# EAGLE design pic24_card (EAGLE 9.6.2)

## Sheet 1 of 2
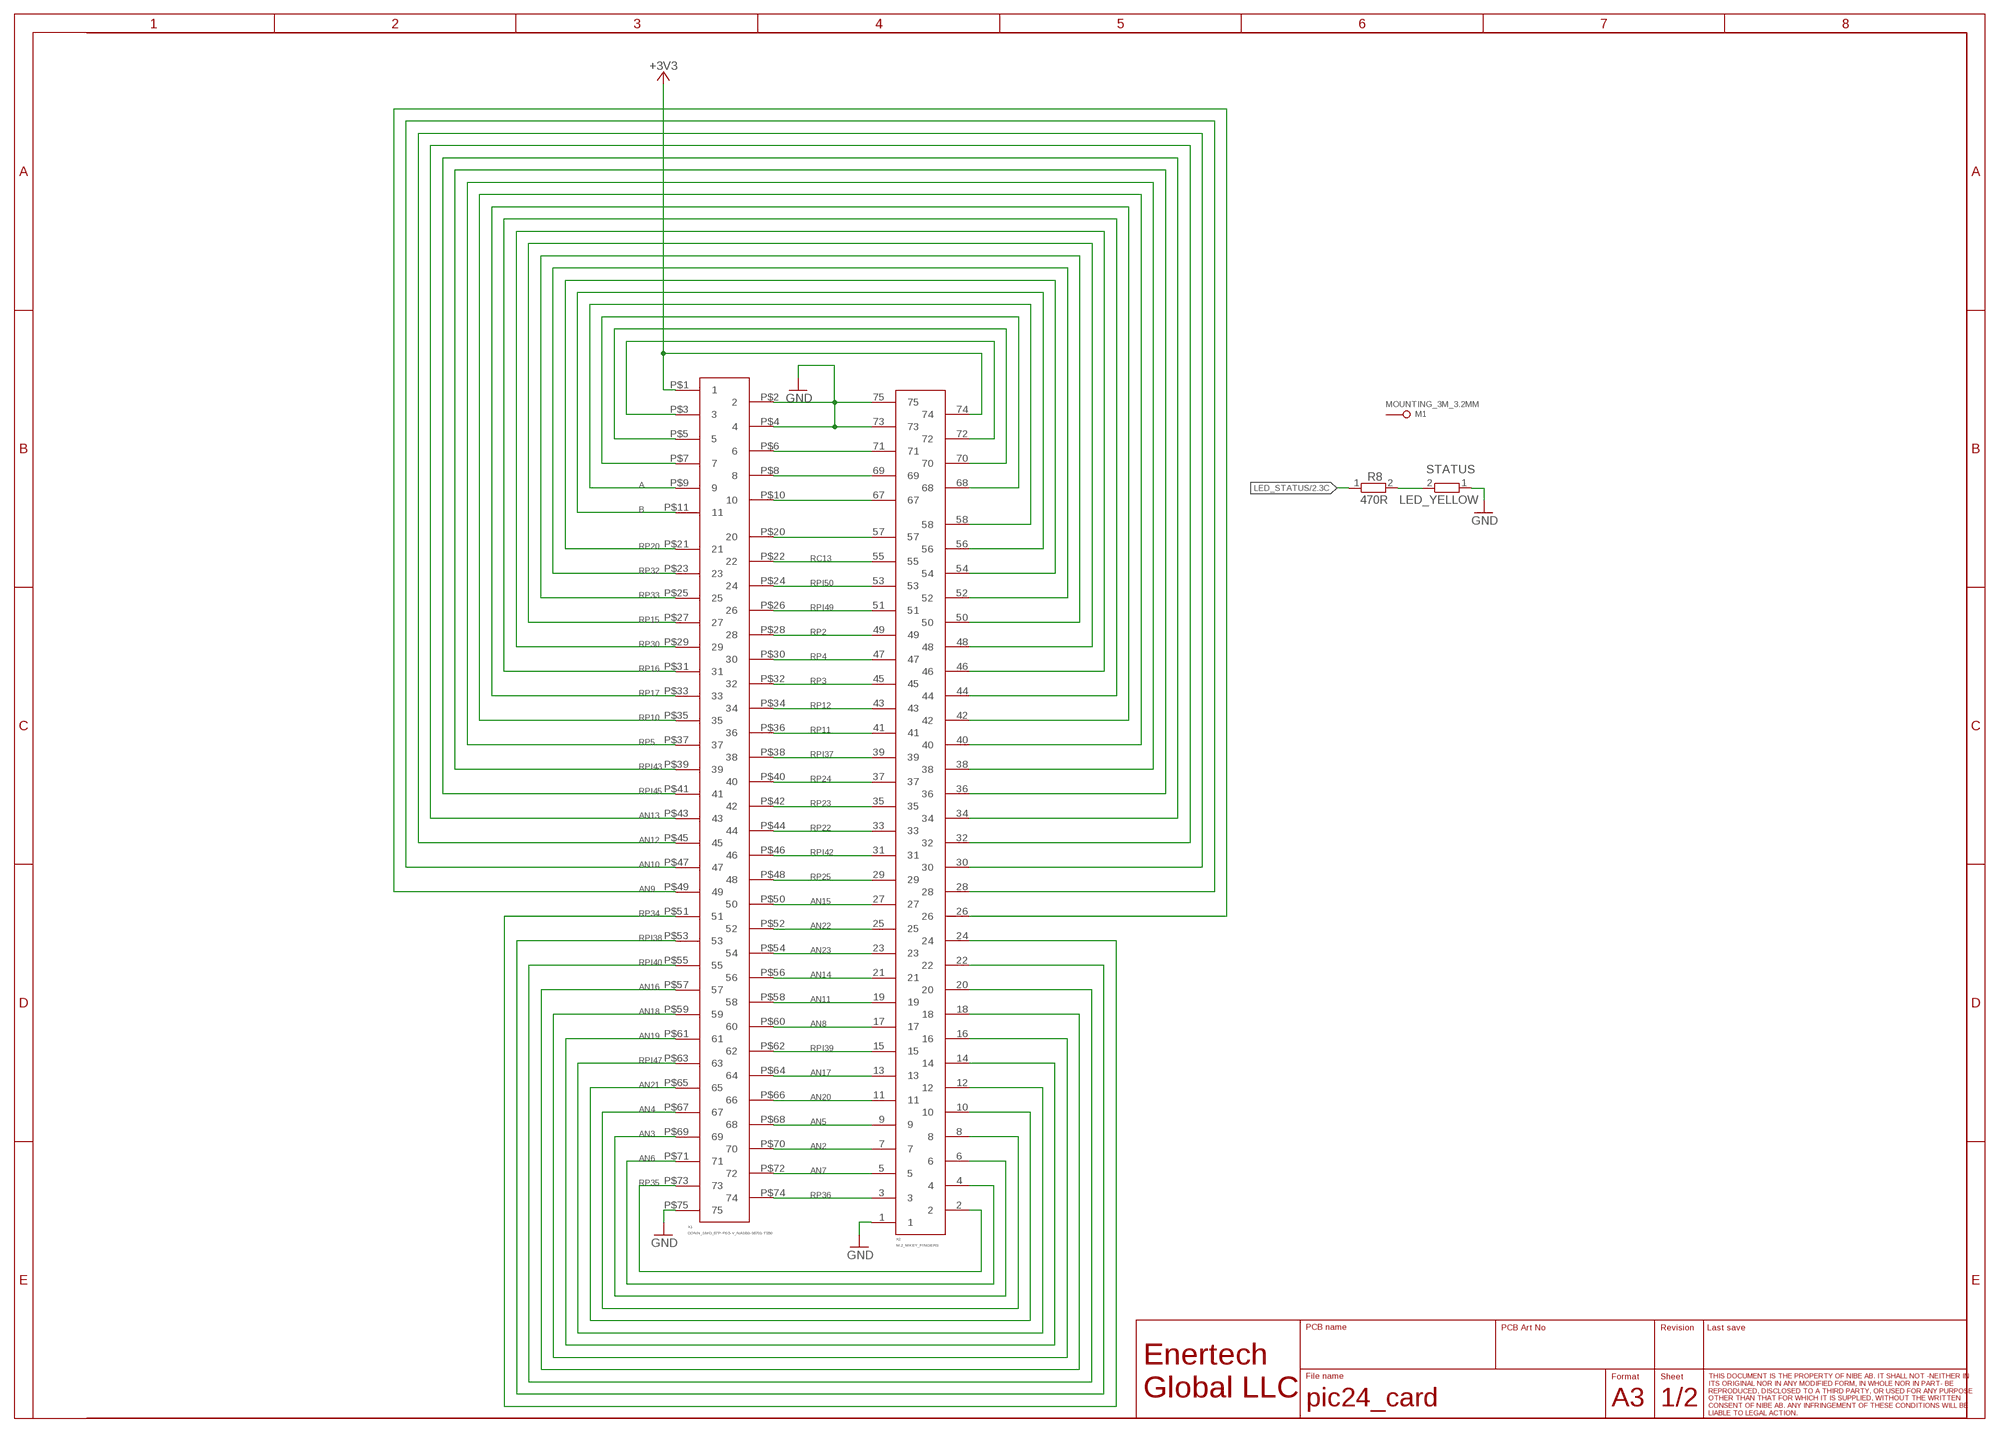
[diagram p0: schematic, sheet 1]

### Parts
M1  MOUNTING_3M_3.2MM  [MOUNTING_3M_3.2MM]
R8  470R  R-EU_R0402_NIBE  [R0402_NIBE]
STATUS  LED_YELLOW  R-EU_R0603  [R0603]
X1  CONN_SMD_67P-P0.5-V_NASB0-S6701-TS50  [CONN_SMD_67P-P0.5-V_NASB0-S6701-TS50]
X2  M.2_MKEY_FINGERS  [M.2_MKEY_FINGERS]

### Nets
+3V3: X1.P$1 X2.74 ; also sheet 2
A: X1.P$9 X2.58 ; also sheet 2
AN2: X1.P$70 X2.7 ; also sheet 2
AN3: X1.P$69 X2.6 ; also sheet 2
AN4: X1.P$67 X2.8 ; also sheet 2
AN5: X1.P$68 X2.9 ; also sheet 2
AN6: X1.P$71 X2.4 ; also sheet 2
AN7: X1.P$72 X2.5 ; also sheet 2
AN8: X1.P$60 X2.17 ; also sheet 2
AN9: X1.P$49 X2.26 ; also sheet 2
AN10: X1.P$47 X2.28 ; also sheet 2
AN11: X1.P$58 X2.19 ; also sheet 2
AN12: X1.P$45 X2.30 ; also sheet 2
AN13: X1.P$43 X2.32 ; also sheet 2
AN14: X1.P$56 X2.21 ; also sheet 2
AN15: X1.P$50 X2.27 ; also sheet 2
AN16: X1.P$57 X2.18 ; also sheet 2
AN17: X1.P$64 X2.13 ; also sheet 2
AN18: X1.P$59 X2.16 ; also sheet 2
AN19: X1.P$61 X2.14 ; also sheet 2
AN20: X1.P$66 X2.11 ; also sheet 2
AN21: X1.P$65 X2.10 ; also sheet 2
AN22: X1.P$52 X2.25 ; also sheet 2
AN23: X1.P$54 X2.23 ; also sheet 2
B: X1.P$11 X2.56 ; also sheet 2
GND: STATUS.1 X1.P$2 X1.P$4 X1.P$75 X2.1 X2.73 X2.75 ; also sheet 2
LED_STATUS: R8.1 ; also sheet 2
N$1: R8.2 STATUS.2
N$30: X1.P$7 X2.68
N$31: X1.P$5 X2.70
N$32: X1.P$3 X2.72
N$36: X1.P$6 X2.71
N$37: X1.P$8 X2.69
N$38: X1.P$10 X2.67
N$39: X1.P$20 X2.57
RC13: X1.P$22 X2.55 ; also sheet 2
RP2: X1.P$28 X2.49 ; also sheet 2
RP3: X1.P$32 X2.45 ; also sheet 2
RP4: X1.P$30 X2.47 ; also sheet 2
RP5: X1.P$37 X2.38 ; also sheet 2
RP10: X1.P$35 X2.40 ; also sheet 2
RP11: X1.P$36 X2.41 ; also sheet 2
RP12: X1.P$34 X2.43 ; also sheet 2
RP15: X1.P$27 X2.48 ; also sheet 2
RP16: X1.P$31 X2.44 ; also sheet 2
RP17: X1.P$33 X2.42 ; also sheet 2
RP20: X1.P$21 X2.54 ; also sheet 2
RP22: X1.P$44 X2.33 ; also sheet 2
RP23: X1.P$42 X2.35 ; also sheet 2
RP24: X1.P$40 X2.37 ; also sheet 2
RP25: X1.P$48 X2.29 ; also sheet 2
RP30: X1.P$29 X2.46 ; also sheet 2
RP32: X1.P$23 X2.52 ; also sheet 2
RP33: X1.P$25 X2.50 ; also sheet 2
RP34: X1.P$51 X2.24 ; also sheet 2
RP35: X1.P$73 X2.2 ; also sheet 2
RP36: X1.P$74 X2.3 ; also sheet 2
RPI37: X1.P$38 X2.39 ; also sheet 2
RPI38: X1.P$53 X2.22 ; also sheet 2
RPI39: X1.P$62 X2.15 ; also sheet 2
RPI40: X1.P$55 X2.20 ; also sheet 2
RPI42: X1.P$46 X2.31 ; also sheet 2
RPI43: X1.P$39 X2.36 ; also sheet 2
RPI45: X1.P$41 X2.34 ; also sheet 2
RPI47: X1.P$63 X2.12 ; also sheet 2
RPI49: X1.P$26 X2.51 ; also sheet 2
RPI50: X1.P$24 X2.53 ; also sheet 2
Unconnected: M1.P$1 M1.P$2 M1.P$3

## Sheet 2 of 2
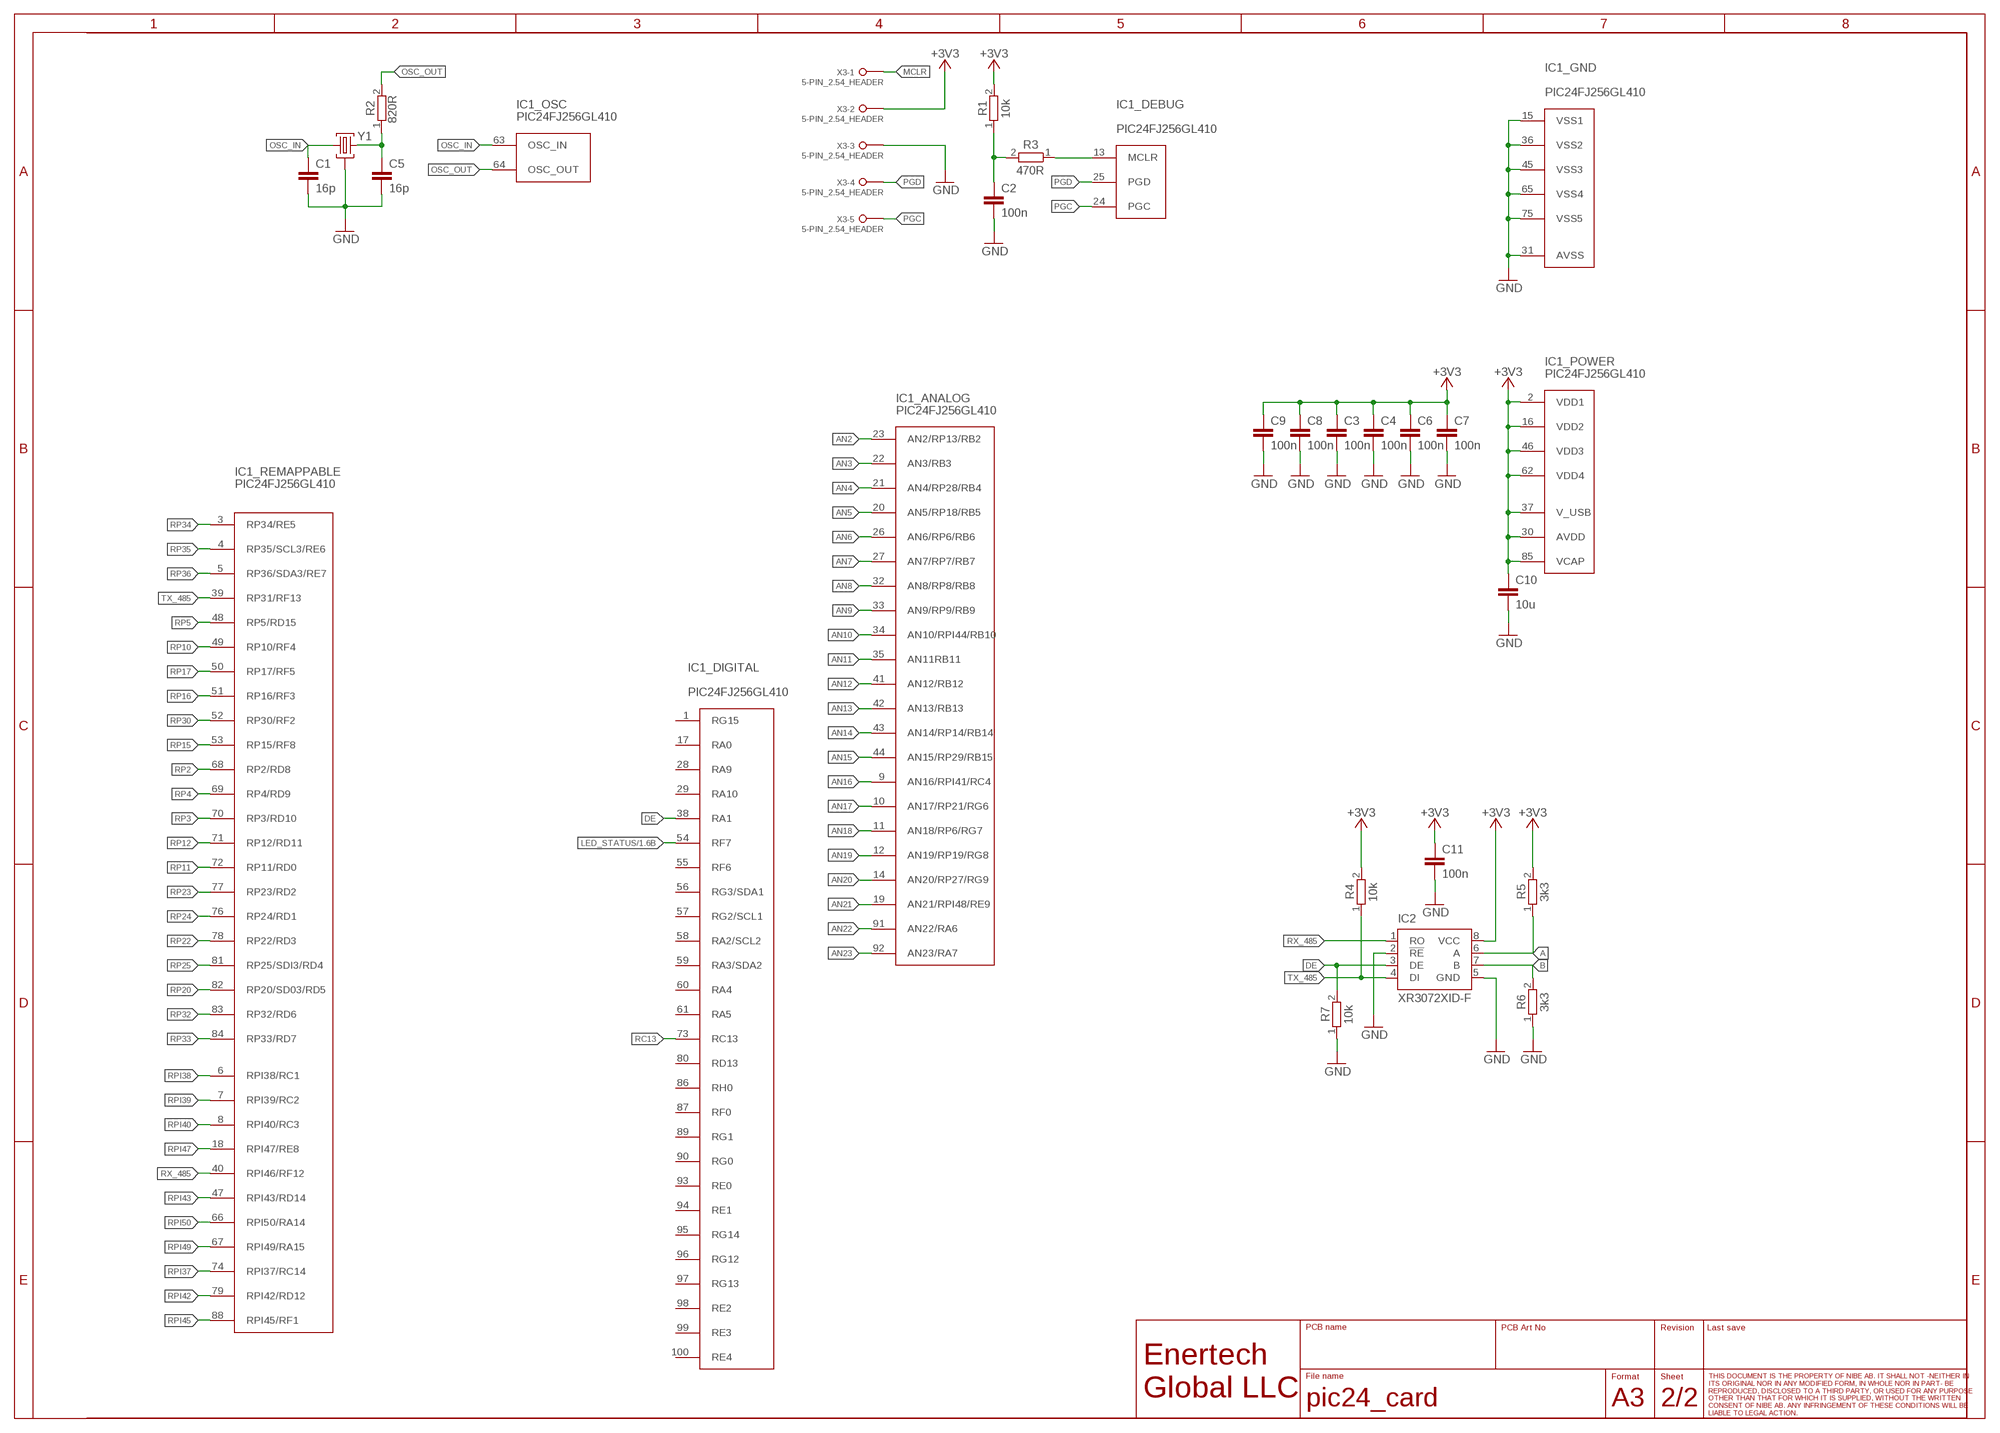
[diagram p1: schematic, sheet 2]

### Parts
C1  16p  C-EUC0402_NIBE  [C0402_NIBE]
C2  100n  C-EUC0402_NIBE  [C0402_NIBE]
C3  100n  C-EUC0402_NIBE  [C0402_NIBE]
C4  100n  C-EUC0402_NIBE  [C0402_NIBE]
C5  16p  C-EUC0402_NIBE  [C0402_NIBE]
C6  100n  C-EUC0402_NIBE  [C0402_NIBE]
C7  100n  C-EUC0402_NIBE  [C0402_NIBE]
C8  100n  C-EUC0402_NIBE  [C0402_NIBE]
C9  100n  C-EUC0402_NIBE  [C0402_NIBE]
C10  10u  C-EUC0805  [C0805]
C11  100n  C-EUC0402_NIBE  [C0402_NIBE]
IC1  PIC24FJ256GL410  [PIC24FJ256GL410]
IC2  XR3072XID-F  [SOIC8]
R1  10k  R-EU_R0402_NIBE  [R0402_NIBE]
R2  820R  R-EU_R0402_NIBE  [R0402_NIBE]
R3  470R  R-EU_R0402_NIBE  [R0402_NIBE]
R4  10k  R-EU_R0402_NIBE  [R0402_NIBE]
R5  3k3  R-EU_R0402_NIBE  [R0402_NIBE]
R6  3k3  R-EU_R0402_NIBE  [R0402_NIBE]
R7  10k  R-EU_R0402_NIBE  [R0402_NIBE]
X3  5-PIN_2.54_HEADER  [2.54MM_5HOLE_TH]
Y1  FA238-12MHZ  [FA238]

### Nets
+3V3: C3.1 C4.1 C6.1 C7.1 C8.1 C9.1 C10.1 C11.1 IC1.2(_POWER:VDD1) IC1.16(_POWER:VDD2) IC1.30(_POWER:AVDD) IC1.37(_POWER:V_USB) IC1.46(_POWER:VDD3) IC1.62(_POWER:VDD4) IC1.85(_POWER:VCAP) IC2.8(VCC) R1.2 R4.2 R5.2 X3.2 ; also sheet 1
A: IC2.6(A) R5.1 ; also sheet 1
AN2: IC1.23(_ANALOG:AN2/RP13/RB2) ; also sheet 1
AN3: IC1.22(_ANALOG:AN3/RB3) ; also sheet 1
AN4: IC1.21(_ANALOG:AN4/RP28/RB4) ; also sheet 1
AN5: IC1.20(_ANALOG:AN5/RP18/RB5) ; also sheet 1
AN6: IC1.26(_ANALOG:AN6/RP6/RB6) ; also sheet 1
AN7: IC1.27(_ANALOG:AN7/RP7/RB7) ; also sheet 1
AN8: IC1.32(_ANALOG:AN8/RP8/RB8) ; also sheet 1
AN9: IC1.33(_ANALOG:AN9/RP9/RB9) ; also sheet 1
AN10: IC1.34(_ANALOG:AN10/RPI44/RB10) ; also sheet 1
AN11: IC1.35(_ANALOG:AN11RB11) ; also sheet 1
AN12: IC1.41(_ANALOG:AN12/RB12) ; also sheet 1
AN13: IC1.42(_ANALOG:AN13/RB13) ; also sheet 1
AN14: IC1.43(_ANALOG:AN14/RP14/RB14) ; also sheet 1
AN15: IC1.44(_ANALOG:AN15/RP29/RB15) ; also sheet 1
AN16: IC1.9(_ANALOG:AN16/RPI41/RC4) ; also sheet 1
AN17: IC1.10(_ANALOG:AN17/RP21/RG6) ; also sheet 1
AN18: IC1.11(_ANALOG:AN18/RP6/RG7) ; also sheet 1
AN19: IC1.12(_ANALOG:AN19/RP19/RG8) ; also sheet 1
AN20: IC1.14(_ANALOG:AN20/RP27/RG9) ; also sheet 1
AN21: IC1.19(_ANALOG:AN21/RPI48/RE9) ; also sheet 1
AN22: IC1.91(_ANALOG:AN22/RA6) ; also sheet 1
AN23: IC1.92(_ANALOG:AN23/RA7) ; also sheet 1
B: IC2.7(B) R6.2 ; also sheet 1
DE: IC1.38(_DIGITAL:RA1) IC2.3(DE) R7.2
GND: C1.2 C2.2 C3.2 C4.2 C5.2 C6.2 C7.2 C8.2 C9.2 C10.2 C11.2 IC1.15(_GND:VSS1) IC1.31(_GND:AVSS) IC1.36(_GND:VSS2) IC1.45(_GND:VSS3) IC1.65(_GND:VSS4) IC1.75(_GND:VSS5) IC2.2(!RE) IC2.5(GND) R6.1 R7.1 X3.3 Y1.2 Y1.4 ; also sheet 1
LED_STATUS: IC1.54(_DIGITAL:RF7) ; also sheet 1
MCLR: IC1.13(_DEBUG:MCLR) R3.1 X3.1
N$66: C2.1 R1.1 R3.2
N$67: C5.1 R2.1 Y1.3
OSC_IN: C1.1 IC1.63(_OSC:OSC_IN) Y1.1
OSC_OUT: IC1.64(_OSC:OSC_OUT) R2.2
PGC: IC1.24(_DEBUG:PGC) X3.5
PGD: IC1.25(_DEBUG:PGD) X3.4
RC13: IC1.73(_DIGITAL:RC13) ; also sheet 1
RP2: IC1.68(_REMAPPABLE:RP2/RD8) ; also sheet 1
RP3: IC1.70(_REMAPPABLE:RP3/RD10) ; also sheet 1
RP4: IC1.69(_REMAPPABLE:RP4/RD9) ; also sheet 1
RP5: IC1.48(_REMAPPABLE:RP5/RD15) ; also sheet 1
RP10: IC1.49(_REMAPPABLE:RP10/RF4) ; also sheet 1
RP11: IC1.72(_REMAPPABLE:RP11/RD0) ; also sheet 1
RP12: IC1.71(_REMAPPABLE:RP12/RD11) ; also sheet 1
RP15: IC1.53(_REMAPPABLE:RP15/RF8) ; also sheet 1
RP16: IC1.51(_REMAPPABLE:RP16/RF3) ; also sheet 1
RP17: IC1.50(_REMAPPABLE:RP17/RF5) ; also sheet 1
RP20: IC1.82(_REMAPPABLE:RP20/SD03/RD5) ; also sheet 1
RP22: IC1.78(_REMAPPABLE:RP22/RD3) ; also sheet 1
RP23: IC1.77(_REMAPPABLE:RP23/RD2) ; also sheet 1
RP24: IC1.76(_REMAPPABLE:RP24/RD1) ; also sheet 1
RP25: IC1.81(_REMAPPABLE:RP25/SDI3/RD4) ; also sheet 1
RP30: IC1.52(_REMAPPABLE:RP30/RF2) ; also sheet 1
RP32: IC1.83(_REMAPPABLE:RP32/RD6) ; also sheet 1
RP33: IC1.84(_REMAPPABLE:RP33/RD7) ; also sheet 1
RP34: IC1.3(_REMAPPABLE:RP34/RE5) ; also sheet 1
RP35: IC1.4(_REMAPPABLE:RP35/SCL3/RE6) ; also sheet 1
RP36: IC1.5(_REMAPPABLE:RP36/SDA3/RE7) ; also sheet 1
RPI37: IC1.74(_REMAPPABLE:RPI37/RC14) ; also sheet 1
RPI38: IC1.6(_REMAPPABLE:RPI38/RC1) ; also sheet 1
RPI39: IC1.7(_REMAPPABLE:RPI39/RC2) ; also sheet 1
RPI40: IC1.8(_REMAPPABLE:RPI40/RC3) ; also sheet 1
RPI42: IC1.79(_REMAPPABLE:RPI42/RD12) ; also sheet 1
RPI43: IC1.47(_REMAPPABLE:RPI43/RD14) ; also sheet 1
RPI45: IC1.88(_REMAPPABLE:RPI45/RF1) ; also sheet 1
RPI47: IC1.18(_REMAPPABLE:RPI47/RE8) ; also sheet 1
RPI49: IC1.67(_REMAPPABLE:RPI49/RA15) ; also sheet 1
RPI50: IC1.66(_REMAPPABLE:RPI50/RA14) ; also sheet 1
RX_485: IC1.40(_REMAPPABLE:RPI46/RF12) IC2.1(RO)
TX_485: IC1.39(_REMAPPABLE:RP31/RF13) IC2.4(DI) R4.1
Unconnected: IC1.1(_DIGITAL:RG15) IC1.17(_DIGITAL:RA0) IC1.28(_DIGITAL:RA9) IC1.29(_DIGITAL:RA10) IC1.55(_DIGITAL:RF6) IC1.56(_DIGITAL:RG3/SDA1) IC1.57(_DIGITAL:RG2/SCL1) IC1.58(_DIGITAL:RA2/SCL2) IC1.59(_DIGITAL:RA3/SDA2) IC1.60(_DIGITAL:RA4) IC1.61(_DIGITAL:RA5) IC1.80(_DIGITAL:RD13) IC1.86(_DIGITAL:RH0) IC1.87(_DIGITAL:RF0) IC1.89(_DIGITAL:RG1) IC1.90(_DIGITAL:RG0) IC1.93(_DIGITAL:RE0) IC1.94(_DIGITAL:RE1) IC1.95(_DIGITAL:RG14) IC1.96(_DIGITAL:RG12) IC1.97(_DIGITAL:RG13) IC1.98(_DIGITAL:RE2) IC1.99(_DIGITAL:RE3) IC1.100(_DIGITAL:RE4)

## Library data of the parts
C1-C11 = _NIBE_rcl:C-EU: Capacitor SMD X_R __%
IC1 = Enertech_Semiconductor:PIC24FJ256GL410
IC2 = _NIBE_SEMICOND_DRIVER:XR3072XID-F: Low Power RS485 Interface Transceiver LOW POWER 18V TOLERANT RS-485/RS-422 +3.3V TRANSCEIVERS, ESD protected 15kV; MF: 1: Exar 2: Texas Instruments; MPN: 1: XR3072XID-F 2: SN65HVD1780D; NIBE_ITEM#: 1: 318303 2: 918170
M1 = ENERTECH_MISC:MOUNTING_3M_3.2MM
R1-R8 STATUS = _NIBE_rcl:R-EU_: RES THK 1% SMD
X1 = ENERTECH_MISC:CONN_SMD_67P-P0.5-V_NASB0-S6701-TS50
X2 = ENERTECH_MISC:M.2_MKEY_FINGERS
X3 = ENERTECH_MISC:5-PIN_2.54_HEADER
Y1 = _NIBE_CPU_MEM_PERH:FA238-12MHZ: Crystal 12.0000MHz 50ppm 12pF 100 Ohm -20°C - 70°C SMD; MF: Epson Toyocom; MPN: FA-238V 12.0000MB-W3; NIBE_ITEM#: 318450

## Board
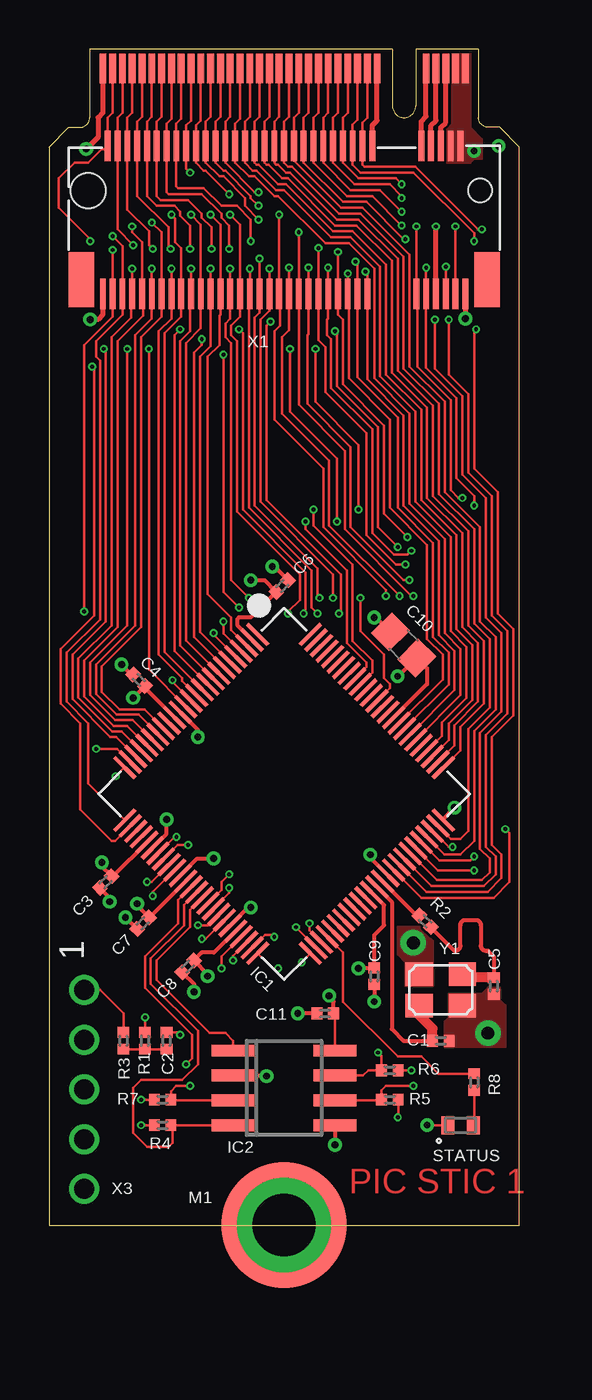
[diagram p2: board, top side]
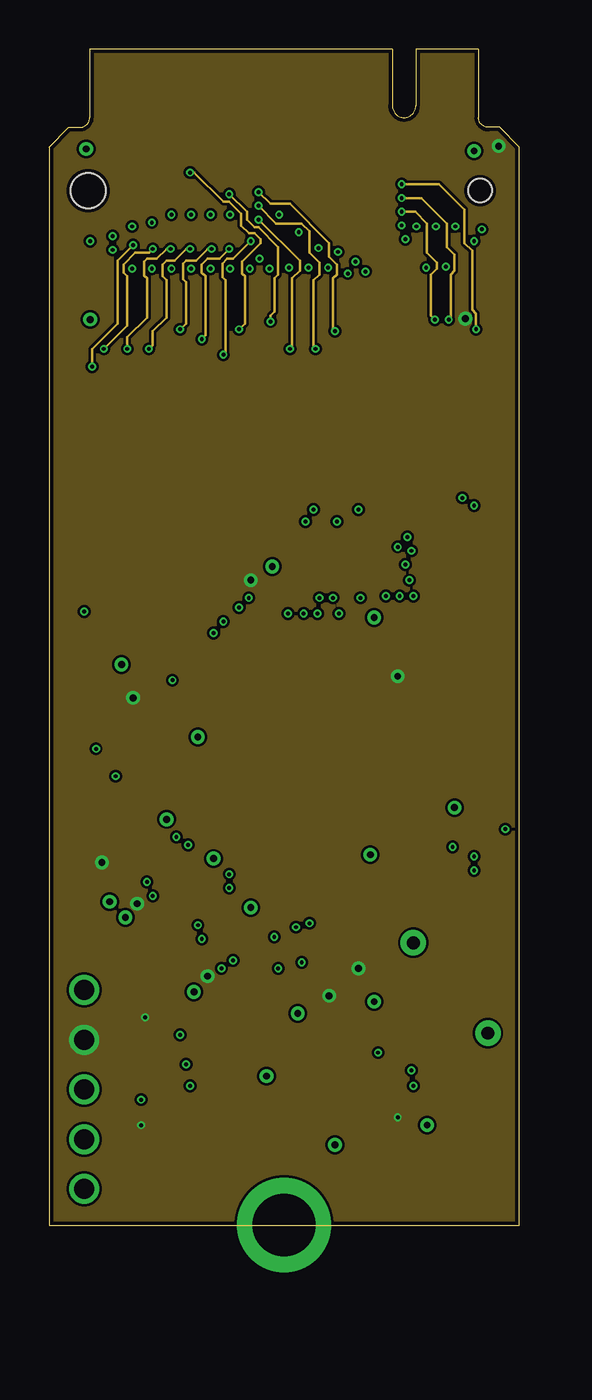
[diagram p3: board, inner layer +3v3]
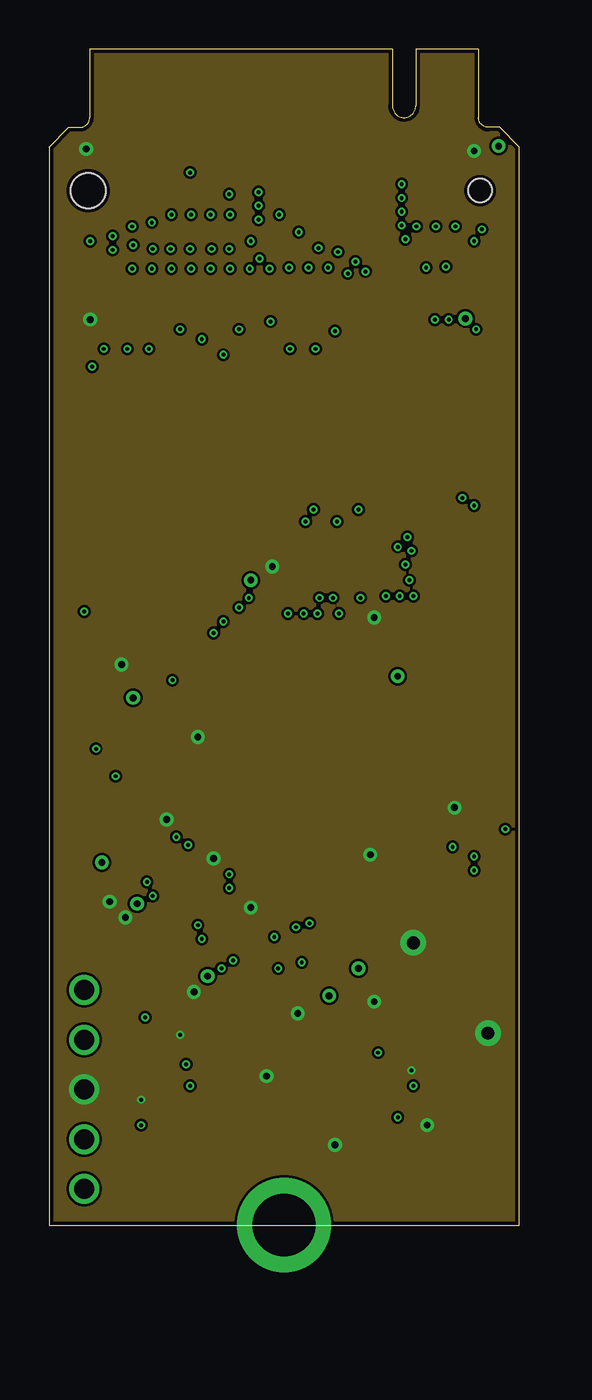
[diagram p4: board, inner layer GND]
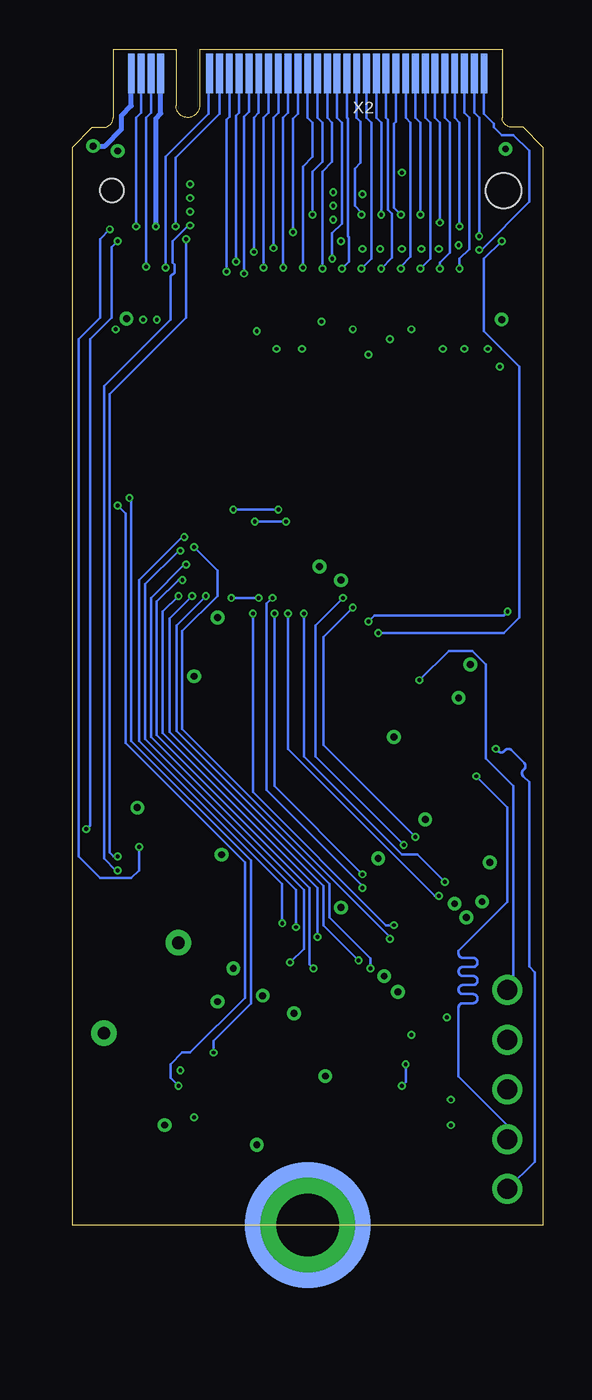
[diagram p5: board, bottom side, seen from below]

Size 24 x 60 mm. Coordinates in mm from the lower left corner, seen from the top.
Outline: 0,0 24,0 24,55 23,56 22.43,56 arc-90 21.93,56.5 21.93,60 18.73,60 18.73,57.1 arc-180 17.52,57.1 17.52,60 2.08,60 2.08,56.5 arc-90 1.57,56 1,56 0,55 0,0
Copper layers (1+2*15+16): Top 0.035mm / dielectric 0.1mm / +3v3 0.035mm / dielectric 1.24mm / GND 0.035mm / dielectric 0.1mm / Bottom 0.035mm
Design rules "enertech_chimera_mcu *": minimum track width 5mil, minimum drill 0.2mm, track to track 5mil, track to pad 5mil, pad to pad 5mil, via to via 5mil, smd to smd 0mil, copper to edge 0.2mm, drill to drill 0.5mm, minimum pad ring 0.05mm, minimum via ring 0.05mm, stop-mask expansion 1mil, vias tented up to drill 14mil, thermal gap 4mil

### Footprints (pad centres in the part's own frame; a part is rotated, then mirrored left to right if it is on the bottom)
C0402_NIBE = smd 0.55 x 0.6: 1 -0.425,0; 2 0.425,0
C0805 = smd 1.3 x 1.5: 1 -0.95,0; 2 0.95,0
PIC24FJ256GL410 = smd 1.5 x 0.2: 1 -6.7,4.8; 2 -6.7,4.4; 3 -6.7,4; 4 -6.7,3.6; 5 -6.7,3.2; 6 -6.7,2.8; 7 -6.7,2.4; 8 -6.7,2; 9 -6.7,1.6; 10 -6.7,1.2; 11 -6.7,0.8; 12 -6.7,0.4; 13 -6.7,0; 14 -6.7,-0.4; 15 -6.7,-0.8; 16 -6.7,-1.2; 17 -6.7,-1.6; 18 -6.7,-2; 19 -6.7,-2.4; 20 -6.7,-2.8; 21 -6.7,-3.2; 22 -6.7,-3.6; 23 -6.7,-4; 24 -6.7,-4.4; 25 -6.7,-4.8; 51 6.7,-4.8; 52 6.7,-4.4; 53 6.7,-4; 54 6.7,-3.6; 55 6.7,-3.2; 56 6.7,-2.8; 57 6.7,-2.4; 58 6.7,-2; 59 6.7,-1.6; 60 6.7,-1.2; 61 6.7,-0.8; 62 6.7,-0.4; 63 6.7,0; 64 6.7,0.4; 65 6.7,0.8; 66 6.7,1.2; 67 6.7,1.6; 68 6.7,2; 69 6.7,2.4; 70 6.7,2.8; 71 6.7,3.2; 72 6.7,3.6; 73 6.7,4; 74 6.7,4.4; 75 6.7,4.8 | smd 0.2 x 1.5: 26 -4.8,-6.7; 27 -4.4,-6.7; 28 -4,-6.7; 29 -3.6,-6.7; 30 -3.2,-6.7; 31 -2.8,-6.7; 32 -2.4,-6.7; 33 -2,-6.7; 34 -1.6,-6.7; 35 -1.2,-6.7; 36 -0.8,-6.7; 37 -0.4,-6.7; 38 0,-6.7; 39 0.4,-6.7; 40 0.8,-6.7; 41 1.2,-6.7; 42 1.6,-6.7; 43 2,-6.7; 44 2.4,-6.7; 45 2.8,-6.7; 46 3.2,-6.7; 47 3.6,-6.7; 48 4,-6.7; 49 4.4,-6.7; 50 4.8,-6.7; 76 4.8,6.7; 77 4.4,6.7; 78 4,6.7; 79 3.6,6.7; 80 3.2,6.7; 81 2.8,6.7; 82 2.4,6.7; 83 2,6.7; 84 1.6,6.7; 85 1.2,6.7; 86 0.8,6.7; 87 0.4,6.7; 88 0,6.7; 89 -0.4,6.7; 90 -0.8,6.7; 91 -1.2,6.7; 92 -1.6,6.7; 93 -2,6.7; 94 -2.4,6.7; 95 -2.8,6.7; 96 -3.2,6.7; 97 -3.6,6.7; 98 -4,6.7; 99 -4.4,6.7; 100 -4.8,6.7
SOIC8 = smd 0.6 x 2.2: 1 -1.905,-2.6; 2 -0.635,-2.6; 3 0.635,-2.6; 4 1.905,-2.6; 5 1.905,2.6; 6 0.635,2.6; 7 -0.635,2.6; 8 -1.905,2.6
MOUNTING_3M_3.2MM = drill 3.2 pad 3.6: P$1 0,0 | smd 6.4 x 6.4: P$2 0,0 | smd 6.4 x 6.4 bottom: P$3 0,0
R0402_NIBE = smd 0.55 x 0.6: 1 -0.425,0; 2 0.425,0
R0603 = smd 0.7 x 0.9: 1 -0.65,0; 2 0.65,0
CONN_SMD_67P-P0.5-V_NASB0-S6701-TS50 = smd 0.3 x 1.55: P$1 -9.25,3.775; P$2 -9,-3.775; P$3 -8.75,3.775; P$4 -8.5,-3.775; P$5 -8.25,3.775; P$6 -8,-3.775; P$7 -7.75,3.775; P$8 -7.5,-3.775; P$9 -7.25,3.775; P$10 -7,-3.775; P$11 -6.75,3.775; P$20 -4.5,-3.775; P$21 -4.25,3.775; P$22 -4,-3.775; P$23 -3.75,3.775; P$24 -3.5,-3.775; P$25 -3.25,3.775; P$26 -3,-3.775; P$27 -2.75,3.775; P$28 -2.5,-3.775; P$29 -2.25,3.775; P$30 -2,-3.775; P$31 -1.75,3.775; P$32 -1.5,-3.775; P$33 -1.25,3.775; P$34 -1,-3.775; P$35 -0.75,3.775; P$36 -0.5,-3.775; P$37 -0.25,3.775; P$38 0,-3.775; P$39 0.25,3.775; P$40 0.5,-3.775; P$41 0.75,3.775; P$42 1,-3.775; P$43 1.25,3.775; P$44 1.5,-3.775; P$45 1.75,3.775; P$46 2,-3.775; P$47 2.25,3.775; P$48 2.5,-3.775; P$49 2.75,3.775; P$50 3,-3.775; P$51 3.25,3.775; P$52 3.5,-3.775; P$53 3.75,3.775; P$54 4,-3.775; P$55 4.25,3.775; P$56 4.5,-3.775; P$57 4.75,3.775; P$58 5,-3.775; P$59 5.25,3.775; P$60 5.5,-3.775; P$61 5.75,3.775; P$62 6,-3.775; P$63 6.25,3.775; P$64 6.5,-3.775; P$65 6.75,3.775; P$66 7,-3.775; P$67 7.25,3.775; P$68 7.5,-3.775; P$69 7.75,3.775; P$70 8,-3.775; P$71 8.25,3.775; P$72 8.5,-3.775; P$73 8.75,3.775; P$74 9,-3.775; P$75 9.25,3.775 | smd 1.3 x 2.8: P$76 10.35,3.05; P$77 -10.35,3.05 | hole 1.2: -10,-1.5 | hole 1.8: 10,-1.5
M.2_MKEY_FINGERS = smd 0.35 x 1.5: 1 -9.25,-1; 3 -8.75,-1; 5 -8.25,-1; 7 -7.75,-1; 9 -7.25,-1; 11 -6.75,-1; 13 -6.25,-1; 15 -5.75,-1; 17 -5.25,-1; 19 -4.75,-1; 21 -4.25,-1; 23 -3.75,-1; 25 -3.25,-1; 27 -2.75,-1; 29 -2.25,-1; 31 -1.75,-1; 33 -1.25,-1; 35 -0.75,-1; 37 -0.25,-1; 39 0.25,-1; 41 0.75,-1; 43 1.25,-1; 45 1.75,-1; 47 2.25,-1; 49 2.75,-1; 51 3.25,-1; 53 3.75,-1; 55 4.25,-1; 57 4.75,-1; 67 7.25,-1; 69 7.75,-1; 71 8.25,-1; 73 8.75,-1; 75 9.25,-1 | smd 0.35 x 2 bottom: 2 -9,-1.25; 4 -8.5,-1.25; 6 -8,-1.25; 8 -7.5,-1.25; 10 -7,-1.25; 12 -6.5,-1.25; 14 -6,-1.25; 16 -5.5,-1.25; 18 -5,-1.25; 20 -4.5,-1.25; 22 -4,-1.25; 24 -3.5,-1.25; 26 -3,-1.25; 28 -2.5,-1.25; 30 -2,-1.25; 32 -1.5,-1.25; 34 -1,-1.25; 36 -0.5,-1.25; 38 0,-1.25; 40 0.5,-1.25; 42 1,-1.25; 44 1.5,-1.25; 46 2,-1.25; 48 2.5,-1.25; 50 3,-1.25; 52 3.5,-1.25; 54 4,-1.25; 56 4.5,-1.25; 58 5,-1.25; 68 7.5,-1.25; 70 8,-1.25; 72 8.5,-1.25; 74 9,-1.25
2.54MM_5HOLE_TH = drill 1.02: 1 0,0; 2 2.54,0; 3 5.08,0; 4 7.62,0; 5 10.16,0
FA238 = smd 1.4 x 1.2: 1 -1.1,-0.8; 2 1.1,-0.8; 3 1.1,0.8; 4 -1.1,0.8

### Placement (x,y rotation side)
C1  20,9.4 0 top
C2  6,9.4 90 top
C3  2.9,17.5 225 top
C4  4.6,27.8 135 top
C5  22.7,12.2 270 top
C6  11.9,32.6 45 top
C7  4.8,15.4 225 top
C8  7.1,13.2 225 top
C9  16.6,12.7 270 top
C10  18.1,29.6 135 top
C11  14.1,10.8 180 top
IC1  12,22 315 top
IC2  12,7 270 top
M1  12,0 0 top
R1  4.9,9.4 90 top
R2  19.2,15.5 135 top
R3  3.8,9.4 270 top
R4  5.8,5.1 180 top
R5  17.4,6.4 0 top
R6  17.4,7.9 180 top
R7  5.8,6.4 0 top
R8  21.7,7.3 270 top
STATUS  21,5.1 0 top
X1  12,51.27 180 top
X2  12,60 0 top
X3  1.8,12 270 top
Y1  20,12 0 top

### Tracks (layer width: path | path; a pad name or v marks a point on that pad's centre or on a via)
+3V3  (via drill 0.2, 0.35)
  Top 0.127: IC2.8 14.6,10.72 C11.1 | R1.2 v4.9,10.6 | R4.2 v4.7,5.1 | R5.2 17.82,5.53 v17.8,5.5
  Top 0.2: IC1.16 4.9,27.4 C4.1 v4.3,26.9 | IC1.30 3.27,17.8 C3.1 2.7,18.3 v2.7,18.5 | IC1.37 5.13,15.7 C7.1 4.5,16.3 v4.5,16.4 | v8.1,12.7 8.1,12.8 C8.1 7.8,13.9 8.43,13.9 IC1.46 | v10.3,32.9 11,32.9 C6.1 10.3,31 9.7,31 9.6,30.9 9.6,30.62 IC1.2 | IC1.62 17.1,16.33 17.1,15.3 16.6,14.8 C9.1 16.57,13.1 v15.8,13.1 | C11.1 14.53,11.4 14.3,11.62 v14.3,11.7 | v17.8,28 18.73,28.93 C10.1 19.3,28.4 19.3,27.6 IC1.85
  Top 0.254: X1.P$1 v21.25,46.25
  Bottom 0.254: v22.95,55.05 22.35,55.05 21.5,55.9 21.5,56.6 21,57.1 X2.74
  pour +3v3 (no thermals): -1,0 -1,61 25,61 25,-1 -1,-1
A  (via drill 0.2, 0.2 pad 0.33)
  Top 0.127: IC2.6 16.94,6.37 R5.1 16.98,6.88 17.2,7.1 v18.6,7.1 | v19.25,48.85 X1.P$9 19.25,43.75 20.8,42.2 20.8,38.1 21.7,37.2 v21.7,36.7
  Bottom 0.127: v18.6,7.1 19,7.5 19,8.2 18.4,8.8 18,8.8 15.2,11.6 15.2,18.5 21.3,24.6 21.3,36.3 v21.7,36.7 | v19.25,48.85 19.25,54.5 17.05,56.7 17.05,58.75 X2.58
AN2  (via drill 0.2, 0.2 pad 0.33)
  Top 0.127: IC1.23 3.43,24.91 3.13,24.91 1.2,26.84 1.2,29.1 2.9,30.8 2.9,44.6 v2.8,44.7 | X2.7 4.25,56.75 4,56.5 X1.P$70 4,51.8 5.1,50.7 5.1,50 v5.3,49.8
  +3v3 0.127: v5.3,49.8 5.1,49.6 4.4,49.6 3.8,49 3.8,48.6 4,48.4 4,45.9 v2.8,44.7
AN3  (via drill 0.2)
  Top 0.127: IC1.22 3.72,25.19 3.22,25.19 1.5,26.91 1.5,28.9 3.2,30.6 3.2,45.3 4.2,46.3 4.2,47.45 X1.P$69 v4.25,48.8
  Bottom 0.127: v4.25,48.8 4.25,49.3 3.75,49.8 3.75,56.5 4,56.75 X2.6
AN4  (via drill 0.2)
  Top 0.127: IC1.21 4,25.48 3.3,25.48 1.8,26.98 1.8,28.8 3.5,30.5 3.5,45.1 4.8,46.4 4.8,47.45 X1.P$67 4.75,50.15 4.25,50.65 v4.25,50.95
  Bottom 0.127: v4.25,50.95 4.25,56.25 4.5,56.5 X2.8
AN5  (via drill 0.2, 0.2 pad 0.33)
  Top 0.127: IC1.20 4.28,25.76 3.38,25.76 2.1,27.04 2.1,28.7 4,30.6 v4,44.7 | X2.9 4.75,56.55 4.5,56.3 X1.P$68 4.5,52.5 6.1,50.9 6.1,49.9 v6.2,49.8
  +3v3 0.127: v6.2,49.8 6,49.8 5.5,49.3 5,49.3 4.85,49.15 4.85,48.45 5,48.3 5,46.3 4,45.3 v4,44.7
AN6  (via drill 0.2)
  Top 0.127: v3.25,50.45 3.75,49.95 X1.P$71 3.75,46.45 2.4,45.1 2.4,44.3 2.6,44.1 2.6,30.9 0.9,29.2 0.9,26.7 2,25.6 2,22.52 IC1.26
  Bottom 0.127: v3.25,50.45 3.25,56.5 3.5,56.75 X2.4
AN7  (via drill 0.2, 0.2 pad 0.33)
  Top 0.127: X2.5 3.75,56.75 3.5,56.5 X1.P$72 3.5,50.8 v4.3,50 | v2.2,43.8 2.3,43.7 2.3,31.1 0.6,29.4 0.6,26.6 1.6,25.6 1.6,21.2 3.2,19.6 3.38,19.6 IC1.27
  +3v3 0.127: v4.3,50 3.5,49.2 3.5,46 2.2,44.7 v2.2,43.8
AN8  (via drill 0.2, 0.2 pad 0.33)
  Top 0.127: v9.7,31.5 8.9,32.3 v8.9,44.4 | IC1.32 6.41,19.8 v6.5,19.8 | X2.17 6.75,56.45 6.5,56.2 X1.P$60 6.5,53 6.6,52.9 7.9,52.9 8.8,52 9.6,52 10.3,51.3 v10.3,50.2
  +3v3 0.127: v10.3,50.2 9.4,49.3 9.1,49.3 8.85,49.05 8.85,48.35 9,48.2 9,44.5 v8.9,44.4
  Bottom 0.127: v6.5,19.8 11.2,24.5 11.2,30 v9.7,31.5
AN9  (via drill 0.2, 0.2 pad 0.33)
  Top 0.127: v10.2,32 9.3,32.9 9.3,45 9,45.3 9,46 9.25,46.25 X1.P$49 v9.25,48.8 | IC1.33 6.57,19.4 v7.1,19.4
  Bottom 0.127: v10.2,32 11.6,30.6 11.6,23.9 v7.1,19.4 | v9.25,48.8 8.75,49.3 8.75,56.25 9,56.5 X2.26
AN10  (via drill 0.2, 0.2 pad 0.33)
  Top 0.127: v12.2,31.2 12.2,31.3 12.8,31.9 12.8,33.2 9.6,36.4 9.6,45.1 9.3,45.4 9.3,45.9 9.75,46.35 X1.P$47 9.75,51.05 v9.25,51.55 | IC1.34 5.24,17.5 v5,17.5
  Bottom 0.127: v5,17.5 6.4,18.9 7.2,18.9 12.2,23.9 v12.2,31.2 | X2.28 9.5,56.5 9.3,56.3 9.3,54.2 9.6,53.9 9.6,52 9.25,51.65 v9.25,51.55
AN11  (via drill 0.2, 0.2 pad 0.33)
  Top 0.127: IC1.35 5.3,17 v5.3,16.8 | X2.19 7.25,56.35 7,56.1 X1.P$58 7,53.9 v7.2,53.7 | v13,31.2 13,31.3 13.1,31.4 13.1,33.3 9.9,36.5 9.9,45.5 v9.7,45.7
  +3v3 0.127: v7.2,53.7 7.4,53.7 8.9,52.2 9.2,52.2 9.8,51.6 9.8,51 10.2,50.6 10.5,50.6 10.8,50.3 10.8,50.1 9.85,49.15 9.85,48.55 10,48.4 10,46 v9.7,45.7
  Bottom 0.127: v5.3,16.8 5.5,16.8 13,24.3 v13,31.2
AN12  (via drill 0.2, 0.2 pad 0.33)
  Top 0.127: IC1.41 8.8,17.1 8.8,17.5 v9.2,17.9 | v10.25,48.8 X1.P$45 10.2,47.45 10.2,36.6 13.4,33.4 13.4,31.5 v13.7,31.2
  Bottom 0.127: v9.2,17.9 13.7,22.4 v13.7,31.2 | v10.25,48.8 9.9,49.15 9.9,50.4 9.95,50.45 9.95,56.45 10,56.5 X2.30
AN13  (via drill 0.2, 0.2 pad 0.33)
  Top 0.127: IC1.42 9.2,16.94 v9.2,17.2 | v10.75,49.3 X1.P$43 10.75,46.55 10.5,46.3 10.5,36.7 13.7,33.5 13.7,32.1 v13.8,32
  Bottom 0.127: v9.2,17.2 9.2,17.3 14.1,22.2 14.1,31.7 v13.8,32 | v10.75,49.3 10.75,50.6 10.25,51.1 10.25,56.25 10.5,56.5 X2.32
AN14  (via drill 0.2, 0.2 pad 0.33)
  Top 0.127: IC1.43 8.13,15.3 v7.6,15.3 | X2.21 7.75,56.35 7.5,56.1 X1.P$56 7.5,54.2 7.9,53.8 8,53.8 v9.2,52.6 | v14.8,31.2 14.9,31.3 14.9,33.2 11.1,37 11.1,45.9 v11.3,46.1
  +3v3 0.127: v9.2,52.6 10.1,51.7 10.1,51.3 10.5,50.9 10.7,50.9 11.7,49.9 11.7,48.5 11.5,48.3 11.5,46.6 11.3,46.4 v11.3,46.1
  Bottom 0.127: v7.6,15.3 8,15.3 14.8,22.1 v14.8,31.2
AN15  (via drill 0.2, 0.2 pad 0.33)
  Top 0.127: IC1.44 7.99,14.6 v7.8,14.6 | X2.27 9.25,56.55 9,56.3 X1.P$50 9,54.2 10.5,52.7 v10.7,52.7 | v17.8,34.6 16.8,35.6 16.8,40.7 14.7,42.8 14.7,45.5 v14.6,45.6
  +3v3 0.127: v10.7,52.7 11.3,52.1 12.3,52.1 14.3,50.1 14.3,49.4 14.7,49 14.7,48.5 14.5,48.3 14.5,45.7 v14.6,45.6
  Bottom 0.127: v7.8,14.6 7.8,14.7 18.4,25.3 18.4,30.3 16.6,32.1 16.6,33.4 v17.8,34.6
AN16  (via drill 0.2)
  Top 0.127: IC1.9 6.7,29.56 6.7,45.1 7.2,45.6 7.2,47.45 X1.P$57 v7.25,48.8
  Bottom 0.127: v7.25,48.8 7.25,48.9 6.75,49.4 6.75,56.25 7,56.5 X2.18
AN17  (via drill 0.2, 0.2 pad 0.33)
  Top 0.127: IC1.10 6.4,29.3 6.4,45.4 v6.7,45.7 | X2.13 5.75,56.55 5.5,56.3 X1.P$64 5.5,52.5 5.7,52.3 7.1,52.3 7.8,51.6 7.8,51.4 8.3,50.9 v8.3,49.8
  +3v3 0.127: v8.3,49.8 8.1,49.8 7.5,49.2 7,49.2 6.85,49.05 6.85,48.25 7,48.1 7,46 v6.7,45.7
AN18  (via drill 0.2)
  Top 0.127: IC1.11 5.9,29.23 5.9,45.5 6.75,46.35 X1.P$59 6.75,49.85 6.45,50.15 6.45,51.35 v6.25,51.55
  Bottom 0.127: v6.25,51.55 6.25,56.25 6.5,56.5 X2.16
AN19  (via drill 0.2)
  Top 0.127: IC1.12 6.8,27.77 6.8,27.9 5.6,29.1 5.6,45.6 6.25,46.25 X1.P$61 v6.25,48.8
  Bottom 0.127: v6.25,48.8 5.75,49.3 5.75,56.25 6,56.5 X2.14
AN20  (via drill 0.2, 0.2 pad 0.33)
  Top 0.127: IC1.14 5.1,28.33 v5.1,44.7 | X2.11 5.25,56.55 5,56.3 X1.P$66 5,52.5 5.5,52 6.4,52 6.7,51.7 6.7,51.5 7.2,51 v7.2,49.8
  +3v3 0.127: v7.2,49.8 7,49.8 6.4,49.2 6,49.2 5.8,49 5.8,48.4 6,48.2 6,46.3 5.3,45.6 5.3,44.9 v5.1,44.7
AN21  (via drill 0.2)
  Top 0.127: IC1.19 4.57,26.04 3.46,26.04 2.4,27.11 2.4,28.6 4.4,30.6 4.4,45.4 5.25,46.25 X1.P$65 v5.25,48.8
  Bottom 0.127: v5.25,48.8 5.25,49.1 4.75,49.6 4.75,56.25 5,56.5 X2.10
AN22  (via drill 0.2, 0.2 pad 0.33)
  Top 0.127: IC1.91 16.5,28.2 16.5,28.8 15.5,29.8 15.5,33.7 13.5,35.7 v13.5,36.5 | X2.25 8.75,56.55 8.5,56.3 X1.P$52 8.5,54.2 8.9,53.8 9,53.8 10.3,52.5 10.3,52.4 v10.7,52 | v15.8,36.5 15.8,39.8 13.6,42 v13.6,44.7
  +3v3 0.127: v10.7,52 11.6,51.1 12.9,51.1 13.3,50.7 13.3,49.6 13.8,49.1 13.8,48.5 13.5,48.2 13.5,44.8 v13.6,44.7
  Bottom 0.127: v15.8,36.5 v13.5,36.5
AN23  (via drill 0.2, 0.2 pad 0.33)
  Top 0.127: IC1.92 16.2,28.46 16.2,28.7 15.2,29.7 15.2,33.4 13.1,35.5 v13.1,35.9 | X2.23 8.25,56.55 8,56.3 X1.P$54 8,54.2 8.7,53.5 8.9,53.5 10,52.4 10,52 v10.7,51.3 | v14.7,35.9 14.7,39.1 12.3,41.5 v12.3,44.7
  +3v3 0.127: v10.7,51.3 12.8,49.2 12.8,48.7 12.4,48.3 12.4,44.8 v12.3,44.7
  Bottom 0.127: v14.7,35.9 v13.1,35.9
B  (via drill 0.2, 0.2 pad 0.33)
  Top 0.127: IC2.7 16.04,7.63 16.3,7.9 R6.2 16.98,8.62 v16.8,8.8 | v18.75,50.95 X1.P$11 18.8,47.45 18.8,43.8 20.5,42.1 20.5,37.5 20.9,37.1 v21.1,37.1
  Bottom 0.127: v16.8,8.8 16.8,9.4 14.9,11.3 14.9,18.6 21,24.7 21,37 v21.1,37.1 | v18.75,50.95 18.75,54.45 16.5,56.7 X2.56
DE  (via drill 0.2 pad 0.33)
  Top 0.127: IC2.3 6.26,6.37 R7.2 6.22,6.83 6.5,7.1 v7.2,7.1 | IC1.38 6.6,16.6 6.6,15.4 4.9,13.7 4.9,12.1 7.3,9.7 7.3,8.5 v7,8.2
  Bottom 0.127: v7,8.2 7,7.3 v7.2,7.1
GND  (via drill 0.2, 0.35, 0.35 pad 0.33, 0.65)
  Top 0.127: C2.2 6.58,9.82 v6.7,9.7 | R7.1 v4.7,6.4 | R6.1 v18.5,7.9 | STATUS.1 v19.3,5.1
  Top 0.2: C8.2 7.4,12.3 v7.4,11.9 | C3.2 3.1,16.7 v3.1,16.5 | C7.2 v3.9,15.7 | IC1.45 10.16,16.2 v10.3,16.2 | IC1.36 7.57,18.7 v8.4,18.7 | IC1.31 6,19.96 v6,20.7 | IC1.15 7.6,25.27 v7.6,24.9 | C4.2 4.2,28.1 v3.7,28.6 | C6.2 11.5,33.6 v11.4,33.6 | C10.2 16.7,31 v16.6,31 | IC1.75 20.13,20.73 v20.7,21.3 | C9.2 v16.6,11.4 | C11.2 v12.7,10.8 | IC1.65 16.4,18.73 v16.4,18.9 | IC2.2 11.06,7.63 v11.1,7.6 | IC2.5 v14.6,4.1
  Top 0.254: X1.P$75 2.75,46.45 2.5,46.2 v2.1,46.2 | X2.1 2.75,56.75 2.5,56.5 2.5,55.5 v1.9,54.9
  other vias: 18.6,14.4 22.4,9.8 21.7,54.8
  pour GND (no thermals): -1,-1 -1,61 25,61 25,-1
  pour Top (no thermals): 20.2,9.1 20.2,10.4 20.4,10.6 20.4,11.8 22.1,11.8 22.4,12.1 23,12.1 23,11.5 23.3,11.2 23.3,9.1
  pour Top (no thermals): 18.2,12.2 18.2,13.4 17.8,13.8 17.8,15.2 18.9,15.2 19.6,14.5 19.6,12.2
  pour Top (no thermals): 20.3,54.2 20.3,55.9 20.6,56.2 20.6,59.8 21.5,59.8 21.5,56 22.1,55.4 22.1,54.4 21.7,54.4 21.5,54.2
LED_STATUS
  Top 0.127: IC1.54 15,13.91 15,11.4 17.8,8.6 19,8.6 19.88,7.72 R8.1
MCLR  (via drill 0.2 pad 0.33)
  Top 0.127: X3.1 2.6,12 3.8,10.8 R3.1 | IC1.13 6.3,27.7 v6.3,27.8
  Bottom 0.127: v6.3,27.8 4.8,29.3 3.6,29.3 2.9,28.6 2.9,23.8 1.5,22.4 1.5,12.3 X3.1
N$1
  Top 0.127: R8.2 21.7,5.15 STATUS.2
N$30  (via drill 0.2)
  Top 0.254: X1.P$7 v19.75,50.95
  Bottom 0.254: v19.75,50.95 19.75,56.45 19.5,56.7 X2.68
N$31  (via drill 0.2)
  Top 0.127: v20.25,48.9 X1.P$5
  Bottom 0.127: v20.25,48.9 20.25,56.5 20,56.75 X2.70
N$32  (via drill 0.2)
  Top 0.127: v20.75,50.95 X1.P$3
  Bottom 0.127: v20.75,50.95 20.75,56.5 20.5,56.75 X2.72
N$36
  Top 0.254: X1.P$6 20,56 20.25,56.25 X2.71
N$37
  Top 0.254: X1.P$8 19.5,56.1 19.75,56.35 X2.69
N$38
  Top 0.254: X1.P$10 19,56.3 19.25,56.55 X2.67
N$39
  Top 0.254: X1.P$20 16.5,56.1 16.75,56.35 X2.57
N$66
  Top 0.127: R3.2 R1.1 C2.1
N$67
  Top 0.2: R2.1 20.7,14 20.74,14 arc90 21,14.26 21,15.31 arc-90 21.26,15.57 21.78,15.57 arc-90 22.04,15.31 22.04,14.26 arc90 22.3,14 22.4,14 22.7,13.7 C5.1
  Top 0.508: C5.1 21.27,12.62 Y1.3
OSC_IN
  Top 0.2: IC1.63 17.5,16.5 17.5,10 18.1,9.4 C1.1
  Top 0.508: C1.1 19.57,10.03 18.9,10.7 Y1.1
OSC_OUT
  Top 0.2: IC1.64 18.77,15.8 R2.2
PGC  (via drill 0.2 pad 0.33)
  Top 0.127: IC1.24 3.48,24.3 v2.4,24.3
  Bottom 0.127: v2.4,24.3 2.28,24.18 arc-90 1.97,24.18 1.92,24.23 arc90 1.6,24.23 0.95,23.58 arc90 0.95,23.26 1,23.21 arc-90 1,22.9 0.7,22.6 0.7,13.2 0.4,12.9 0.4,3.24 X3.5
PGD  (via drill 0.2 pad 0.33)
  Top 0.127: IC1.25 3.84,23.34 v3.4,22.9
  Bottom 0.127: v3.4,22.9 1.8,21.3 1.8,16.5 4.3,14 4.3,13.85 arc-90 4.08,13.63 3.56,13.63 arc90 3.34,13.41 3.34,13.39 arc90 3.56,13.17 4.08,13.17 arc-90 4.3,12.95 4.3,12.93 arc-90 4.08,12.71 3.56,12.71 arc90 3.34,12.49 3.34,12.47 arc90 3.56,12.25 4.08,12.25 arc-90 4.3,12.02 4.3,12.01 arc-90 4.08,11.78 3.56,11.78 arc90 3.34,11.56 3.34,11.54 arc90 3.56,11.32 4.08,11.32 arc-90 4.3,11.1 4.3,7.6 1.8,5.1 X3.4
RC13  (via drill 0.2, 0.2 pad 0.33)
  Top 0.127: X2.55 16.25,56.5 16,56.25 X1.P$22 16,54.1 16.1,54 18.7,54 21.9,50.8 v22.1,50.8 | IC1.73 19.61,20.09 20.4,19.3 v20.6,19.3
  Bottom 0.127: v22.1,50.8 22.6,50.3 22.6,46.3 23.7,45.2 23.7,18.8 22.6,17.7 21,17.7 20.6,18.1 v20.6,19.3
RP2  (via drill 0.2, 0.2 pad 0.33)
  Top 0.127: IC1.68 19.53,17.3 22.2,17.3 22.8,17.9 22.8,18.8 22.3,19.3 22.3,25 23.4,26.1 23.4,30.3 22.6,31.1 22.6,37.2 21.4,38.4 21.4,42.4 20.4,43.4 v20.4,46.2 | X2.49 14.75,56.75 14.5,56.5 X1.P$28 14.5,54.2 15.6,53.1 17.4,53.1 18,52.5 v18,52.4
  +3v3 0.127: v18,52.4 19,52.4 20.3,51.1 20.3,49.9 20.7,49.5 20.7,48.7 20.5,48.5 20.5,46.3 v20.4,46.2
RP3  (via drill 0.2 pad 0.33)
  Top 0.127: IC1.70 19.86,18.1 v21.7,18.1 | X2.45 13.75,56.75 13.5,56.5 X1.P$32 13.5,54.2 15.2,52.5 16.5,52.5 v18,51
  Bottom 0.127: v21.7,18.1 21.8,18.1 22.4,18.7 22.4,42.8 19,46.2 19,48.4 18.8,48.6 18.8,49 18.9,49.1 18.9,50.2 18.1,51 v18,51
RP4  (via drill 0.2, 0.2 pad 0.33)
  Top 0.127: X2.47 14.25,56.75 14,56.5 X1.P$30 14,54.2 15.4,52.8 16.9,52.8 v18,51.7 | v19.7,46.2 19.7,43.7 21.1,42.3 21.1,38.3 22.3,37.1 22.3,31 23.1,30.2 23.1,26.2 22,25.1 22,19.2 22.5,18.7 22.5,18 22.1,17.6 19.79,17.6 IC1.69
  +3v3 0.127: v18,51.7 18.7,51.7 19.3,51.1 19.3,49.6 19.8,49.1 19.8,48.8 19.5,48.5 19.5,46.4 v19.7,46.2
RP5  (via drill 0.2, 0.2 pad 0.33)
  Top 0.127: IC1.48 9.4,13.74 v9.4,13.5 | v12.25,48.85 X1.P$37 12.25,45.65 11.9,45.3 11.9,41.4 14.3,39 14.3,35.7 v17.9,32.1
  Bottom 0.127: v9.4,13.5 11.2,15.3 11.2,17.3 19.05,25.15 19.05,30.95 v17.9,32.1 | v12.25,48.85 12.25,54 11.75,54.5 11.75,56.25 12,56.5 X2.38
RP10  (via drill 0.2, 0.2 pad 0.33)
  Top 0.127: IC1.49 11.02,14.8 11.4,14.8 v11.5,14.7 | v12.75,50.65 X1.P$35 12.75,41.85 15.1,39.5 15.1,35.5 18.5,32.1 v18.6,32.1
  Bottom 0.127: v11.5,14.7 11.5,17.2 19.4,25.1 19.4,31.3 v18.6,32.1 | v12.75,50.65 12.75,56.45 12.5,56.7 X2.40
RP11
  Top 0.127: IC1.72 20.19,18.9 21,18.9 21.7,19.6 21.7,25.2 22.8,26.3 22.8,30 22,30.8 22,35.6 20.2,37.4 20.2,42 18.4,43.8 18.4,49.5 16,51.9 14.9,51.9 12.5,54.3 X1.P$36 12.5,56.5 12.75,56.75 X2.41
RP12  (via drill 0.2 pad 0.33)
  Top 0.127: IC1.71 19.93,18.6 21.5,18.6 v21.7,18.8 | X2.43 13.25,56.75 13,56.5 X1.P$34 13,54.2 15,52.2 16.2,52.2 18.1,50.3 v18.2,50.3
  Bottom 0.127: v21.7,18.8 21.9,18.8 22.1,19 22.1,42.4 18.2,46.3 v18.2,50.3
RP15  (via drill 0.2, 0.2 pad 0.33)
  Top 0.127: IC1.53 13.3,15.04 v13.3,15.4 | v14.75,49.65 X1.P$27 14.75,46.45 15,46.2 15,42.9 17.1,40.8 17.1,36.3 v18.3,35.1
  Bottom 0.127: v13.3,15.4 13.3,17.4 20.6,24.7 20.6,32.9 18.4,35.1 v18.3,35.1 | v14.75,49.65 14.75,56.5 14.5,56.75 X2.48
RP16  (via drill 0.2, 0.2 pad 0.33)
  Top 0.127: IC1.51 12.9,13.43 v12.9,13.4 | v13.75,49.85 X1.P$31 13.75,45.15 14.1,44.8 14.1,42.5 16.2,40.4 16.2,35.2 17.7,33.7 v18.2,33.7
  Bottom 0.127: v12.9,13.4 12.2,14.1 12.2,17.1 20,24.9 20,32 18.3,33.7 v18.2,33.7 | v13.75,49.85 13.75,56.5 13.5,56.75 X2.44
RP17  (via drill 0.2, 0.2 pad 0.33)
  Top 0.127: IC1.50 11.43,13.1 v11.7,13.1 | v13.25,48.85 X1.P$33 13.25,45.45 13.2,45.4 13.2,41.9 15.4,39.7 15.4,35.6 18.1,32.9 v18.4,32.9
  Bottom 0.127: v11.7,13.1 11.9,13.3 11.9,17.2 19.7,25 19.7,31.8 18.6,32.9 v18.4,32.9 | v13.25,48.85 13.25,56.5 13,56.75 X2.42
RP20  (via drill 0.2)
  Top 0.127: IC1.82 20.7,27.3 20.7,29.3 19.9,30.1 19.9,34.9 18.1,36.7 18.1,41.3 16.25,43.15 X1.P$21 16.25,48.6 16.2,48.65 v16.15,48.65
  Bottom 0.127: v16.15,48.65 16.15,56.4 16,56.55 X2.54
RP22
  Top 0.127: X2.33 10.75,56.55 10.5,56.3 X1.P$44 10.5,54.2 10.6,54.1 10.7,54.1 11.7,53.1 12.1,53.1 14.5,50.7 15.5,50.7 17.2,49 17.2,43.4 19,41.6 19,37 20.8,35.2 20.8,30.4 21.6,29.6 21.6,26.8 20.4,25.6 20.4,24.74 IC1.78
RP23
  Top 0.127: X2.35 11.25,56.55 11,56.3 X1.P$42 11,54.2 11.1,54.1 11.2,54.1 11.9,53.4 12.2,53.4 14.6,51 15.7,51 17.5,49.2 17.5,43.5 19.3,41.7 19.3,37.1 21.1,35.3 21.1,30.5 21.9,29.7 21.9,26.7 20.7,25.5 20.7,24.48 IC1.77
RP24
  Top 0.127: X2.37 11.75,56.55 11.5,56.3 X1.P$40 11.5,54.2 11.6,54.1 11.7,54.1 12.1,53.7 12.3,53.7 14.7,51.3 15.8,51.3 17.8,49.3 17.8,43.6 19.6,41.8 19.6,37.2 21.4,35.4 21.4,30.6 22.2,29.8 22.2,26.6 21,25.4 21,24.21 IC1.76
RP25
  Top 0.127: X2.29 9.75,56.45 9.5,56.2 X1.P$48 9.5,54.2 10.2,53.5 10.5,53.5 11.5,52.5 11.7,52.5 14.1,50.1 15.3,50.1 16.6,48.8 16.6,43.2 18.4,41.4 18.4,36.8 20.2,35 20.2,30.2 21,29.4 21,27.04 IC1.81
RP30  (via drill 0.2, 0.2 pad 0.33)
  Top 0.127: IC1.52 12.6,15.18 v12.6,15.2 | v14.25,48.85 X1.P$29 14.25,46.25 14.2,46.2 14.2,45.4 14.4,45.2 14.4,42.7 16.5,40.6 16.5,35.3 17.6,34.2 18.3,34.2 v18.5,34.4
  Bottom 0.127: v12.6,15.2 12.6,17.1 20.3,24.8 20.3,32.7 18.6,34.4 v18.5,34.4 | v14.25,48.85 14.25,56.5 14,56.75 X2.46
RP32  (via drill 0.2)
  Top 0.127: v15.65,49.15 15.65,49.1 15.75,49 X1.P$23 15.75,43.25 17.8,41.2 17.8,36.6 19.6,34.8 19.6,30 20.4,29.2 20.4,27.57 IC1.83
  Bottom 0.127: v15.65,49.15 15.65,56.6 15.5,56.75 X2.52
RP33  (via drill 0.2)
  Top 0.127: v15.25,48.55 X1.P$25 15.3,47.45 15.3,43.2 17.4,41.1 17.4,36.6 19.3,34.7 19.3,29.9 20.1,29.1 20.1,27.84 IC1.84
  Bottom 0.127: v15.25,48.55 15.25,56.55 15,56.8 X2.50
RP34  (via drill 0.2)
  Top 0.127: v8.25,51.55 8.75,51.05 X1.P$51 8.75,46.45 8.7,46.4 8.7,44.9 8.1,44.3 8.1,32.2 9.3,31 9.3,30.36 IC1.3
  Bottom 0.127: v8.25,51.55 8.25,56.25 8.5,56.5 X2.24
RP35  (via drill 0.2)
  Top 0.127: v3.25,49.75 X1.P$73 3.25,46.35 1.8,44.9 v1.8,31.3 | IC1.4 8.9,30.19 v8.9,30.8
  Bottom 0.127: X2.2 3,56.7 2.5,56.2 2.5,56 2.1,55.6 1.5,55.6 0.7,54.8 0.7,52.2 3.15,49.75 v3.25,49.75 | v8.9,30.8 8.6,31.1 2,31.1 v1.8,31.3
RP36  (via drill 0.2, 0.2 pad 0.33)
  Top 0.127: X2.3 3.25,56.75 3,56.5 X1.P$74 2.85,54.9 2.7,54.9 2,54.2 1.3,54.2 0.5,53.4 0.5,51.9 2.1,50.3 v2.1,50.2 | IC1.5 8.4,30.12 v8.4,30.2
  Bottom 0.127: v2.1,50.2 3,49.3 3,45.6 1.2,43.8 1.2,31 2,30.2 v8.4,30.2
RPI37
  Top 0.127: IC1.74 20.52,19.7 21,19.7 21.4,20.1 21.4,25.3 22.5,26.4 22.5,29.9 21.7,30.7 21.7,35.5 19.9,37.3 19.9,41.9 18.1,43.7 18.1,49.4 15.9,51.6 14.8,51.6 12.4,54 12.2,54 12,54.2 X1.P$38 12,56.3 12.25,56.55 X2.39
RPI38  (via drill 0.2)
  Top 0.127: IC1.6 7.7,30.26 7.7,44.3 8.25,44.85 X1.P$53 v8.25,48.8
  Bottom 0.127: v8.25,48.8 7.7,49.35 7.7,51.6 7.9,51.8 7.9,56.4 8,56.5 X2.22
RPI39  (via drill 0.2, 0.2 pad 0.33)
  Top 0.127: IC1.7 7.4,29.99 7.4,44.5 7.8,44.9 v7.8,45.2 | X2.15 6.25,56.45 6,56.2 X1.P$62 6,52.7 6.1,52.6 7.8,52.6 8.8,51.6 8.8,51.4 9.2,51 v9.2,49.8
  +3v3 0.127: v9.2,49.8 8.7,49.3 8.1,49.3 7.8,49 7.8,48.6 8,48.4 8,45.4 v7.8,45.2
RPI40  (via drill 0.2)
  Top 0.127: IC1.8 7,29.83 7,45 7.75,45.75 X1.P$55 7.75,51.05 v7.25,51.55
  Bottom 0.127: v7.25,51.55 7.6,51.9 7.6,56.2 7.5,56.3 X2.20
RPI42
  Top 0.127: IC1.79 20.05,24.95 20.05,25.65 21.3,26.9 21.3,29.5 20.5,30.3 20.5,35.1 18.7,36.9 18.7,41.5 16.9,43.3 16.9,48.9 15.4,50.4 14.4,50.4 12,52.8 11.6,52.8 10.6,53.8 10.4,53.8 10,54.2 X1.P$46 10,56.3 10.25,56.55 X2.31
RPI43  (via drill 0.2, 0.2 pad 0.33)
  Top 0.127: IC1.47 8.8,13.71 v8.8,13.1 | v11.75,51.55 X1.P$39 11.8,47.45 11.8,45.9 11.5,45.6 11.5,41.1 14,38.6 14,35.6 17.2,32.4 v17.2,32.1
  Bottom 0.127: v8.8,13.1 8.8,13.6 10.9,15.7 10.9,17.4 18.7,25.2 18.7,30.6 v17.2,32.1 | v11.75,51.55 11.75,53.75 11.25,54.25 11.25,56.25 11.5,56.5 X2.36
RPI45  (via drill 0.2)
  Top 0.127: v11.25,48.8 X1.P$41 11.25,46.65 10.8,46.2 10.8,36.9 14.5,33.2 v14.5,32 | v15.9,32 15.9,30.3 17.1,29.1 17.1,27.9 17.4,27.6 17.4,27.4 IC1.88
  Bottom 0.127: v11.25,48.8 11.25,53.75 10.75,54.25 10.75,56.25 11,56.5 X2.34 | v15.9,32 v14.5,32
RPI47  (via drill 0.2)
  Top 0.127: IC1.18 4.87,26.3 3.6,26.3 2.7,27.2 2.7,28.5 4.7,30.5 4.7,45.3 5.75,46.35 X1.P$63 5.75,50.65 v5.25,51.15
  Bottom 0.127: v5.25,51.15 5.25,56.25 5.5,56.5 X2.12
RPI49  (via drill 0.2, 0.2 pad 0.33)
  Top 0.127: IC1.67 19.26,17 22.4,17 23.1,17.7 23.1,18.9 22.6,19.4 22.6,24.9 23.7,26 23.7,30.4 22.9,31.2 22.9,37.4 21.7,38.6 21.7,45.6 v21.8,45.7 | X2.51 15.25,56.75 15,56.5 X1.P$26 15,54.2 15.8,53.4 17.7,53.4 v18,53.1
  +3v3 0.127: v18,53.1 19.9,53.1 21.2,51.8 21.2,50.1 21.6,49.7 21.6,46.7 21.8,46.5 v21.8,45.7
RPI50  (via drill 0.2 pad 0.33)
  Top 0.127: X2.53 15.75,56.4 15.5,56.15 X1.P$24 15.5,54.1 15.9,53.7 18.6,53.7 21.7,50.6 v21.7,50.2 | IC1.66 19,16.7 22.7,16.7 23.5,17.5 23.5,20 v23.3,20.2
  Bottom 0.127: v21.7,50.2 22,49.9 22,46.3 23.1,45.2 23.1,20.4 v23.3,20.2
RX_485
  Top 0.127: IC1.40 7.2,16.07 7.2,16 7.2,15.7 7.2,15.2 5.5,13.5 5.5,12.5 8.2,9.8 9,9.8 9.4,9.4 IC2.1
TX_485
  Top 0.127: IC2.4 R4.1 | R4.1 | IC1.39 6.9,16.33 6.9,15.3 5.2,13.6 5.2,12.3 7.6,9.9 7.6,8.2 6.8,7.4 4.7,7.4 4.3,7 4.3,4.7 5,4 6.1,4 6.3,4.2 6.3,5.03 R4.1

### Text on the board
Top: PIC STIC 1